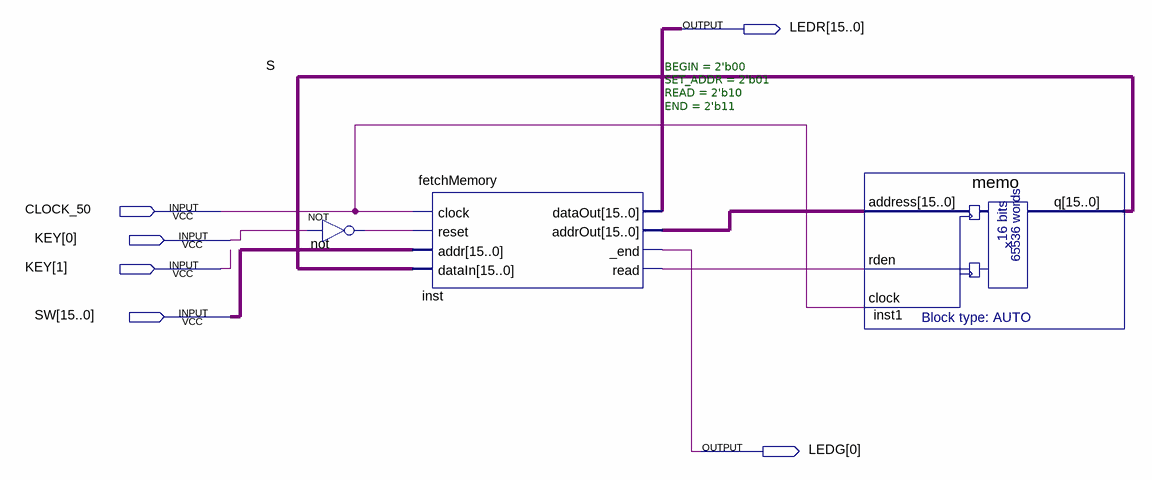
[diagram p0: schematic sheet]
// Quartus schematic testeMemoria.bdf as structural Verilog: 3 symbols, 6 pins
module testeMemoria (
  input  CLOCK_50,
  input  [1:0] KEY,
  input  [15:0] SW,
  output [15:0] LEDR,
  output [0:0] LEDG
);

  wire inst_read, S;
  wire [15:0] inst1_q, inst_addrout;

  not \not  (S, KEY[0]);
  fetchMemory #(.BEGIN(2'b00), .SET_ADDR(2'b01), .READ(2'b10), .END(2'b11)) inst (
    .clock(CLOCK_50), .reset(S), .addr(SW), .dataIn(inst1_q), .dataOut(LEDR), .addrOut(inst_addrout),
    ._end(LEDG[0]), .read(inst_read));
  memo inst1 (.address(inst_addrout), .rden(inst_read), .clock(CLOCK_50), .q(inst1_q));
endmodule
